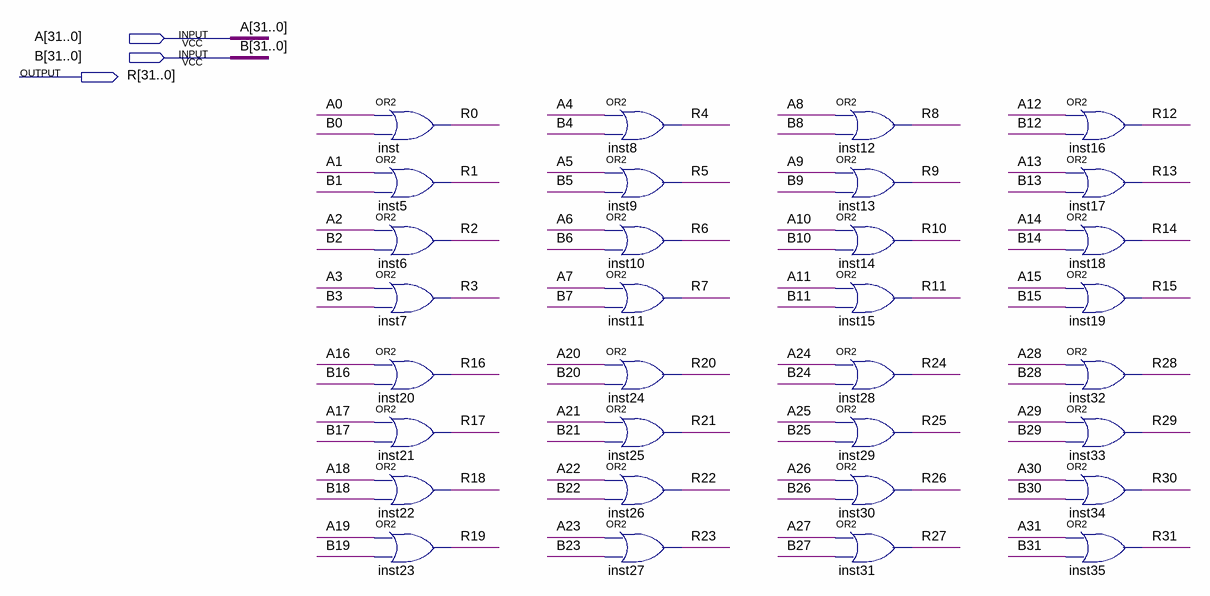
[diagram p0: schematic sheet]
// Quartus schematic or_32_bit.bdf as structural Verilog: 32 symbols, 3 pins
module or_32_bit (
  input  [31:0] A,
  input  [31:0] B,
  output [31:0] R
);

  or inst (R[0], A[0], B[0]);
  or inst5 (R[1], A[1], B[1]);
  or inst6 (R[2], A[2], B[2]);
  or inst7 (R[3], A[3], B[3]);
  or inst20 (R[16], A[16], B[16]);
  or inst21 (R[17], A[17], B[17]);
  or inst22 (R[18], A[18], B[18]);
  or inst23 (R[19], A[19], B[19]);
  or inst8 (R[4], A[4], B[4]);
  or inst9 (R[5], A[5], B[5]);
  or inst10 (R[6], A[6], B[6]);
  or inst11 (R[7], A[7], B[7]);
  or inst24 (R[20], A[20], B[20]);
  or inst25 (R[21], A[21], B[21]);
  or inst26 (R[22], A[22], B[22]);
  or inst27 (R[23], A[23], B[23]);
  or inst12 (R[8], A[8], B[8]);
  or inst13 (R[9], A[9], B[9]);
  or inst14 (R[10], A[10], B[10]);
  or inst15 (R[11], A[11], B[11]);
  or inst28 (R[24], A[24], B[24]);
  or inst29 (R[25], A[25], B[25]);
  or inst30 (R[26], A[26], B[26]);
  or inst31 (R[27], A[27], B[27]);
  or inst16 (R[12], A[12], B[12]);
  or inst17 (R[13], A[13], B[13]);
  or inst18 (R[14], A[14], B[14]);
  or inst19 (R[15], A[15], B[15]);
  or inst32 (R[28], A[28], B[28]);
  or inst33 (R[29], A[29], B[29]);
  or inst34 (R[30], A[30], B[30]);
  or inst35 (R[31], A[31], B[31]);
endmodule
